# Altium schematic sheet sensor.SchDoc
size A4; SheetNumber: 4; SheetTotal: 4
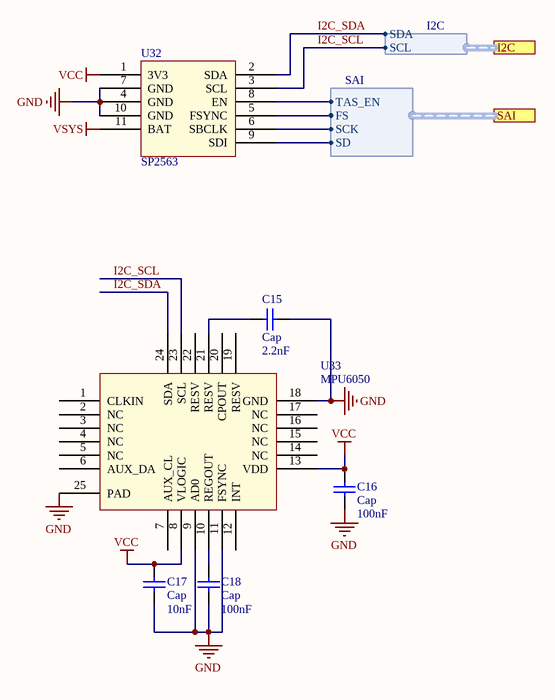
[diagram p0: sensor.SchDoc]

## Parts
C15  Cap  value 2.2nF  [0402]
C16  Cap  value 100nF  [0402]
C17  Cap  value 10nF  [0402]
C18  Cap  value 100nF  [0402]
U32  SP2563  [SP2563]
U33  MPU6050  [QFN24_AW9523B]

## Ports
I2C (harness I2C), SAI (harness SAI)

## Harnesses
I2C: SDA, SCL
SAI: TAS_EN, SCK, FS, SD

## Nets
GND: C15.1 C16.2 C17.2 C18.2 U32.4(GND) U32.7(GND) U32.10(GND) U33.9(AD0) U33.11(FSYNC) U33.18(GND) U33.25(PAD)
VCC: C16.1 C17.1 U32.1(3V3) U33.8(VLOGIC) U33.13(VDD)
VSYS: U32.11(BAT)
I2C_SCL: U32.3(SCL) U33.23(SCL) ; port I2C.SCL
I2C_SDA: U32.2(SDA) U33.24(SDA) ; port I2C.SDA
NetC15_2: C15.2 U33.21(RESV)
NetC18_1: C18.1 U33.10(REGOUT)
NetU32_5: U32.5(FSYNC) ; port SAI.FS
NetU32_6: U32.6(SBCLK) ; port SAI.SCK
NetU32_8: U32.8(EN) ; port SAI.TAS_EN
NetU32_9: U32.9(SDI) ; port SAI.SD

Not connected (* = marked no-connect by the designer): U33 1(CLKIN) 2(NC) 3(NC) 4(NC) 5(NC) 6(AUX_DA) 7(AUX_CL) 12(INT) 14(NC) 15(NC) 16(NC) 17(NC) 19(RESV) 20(CPOUT) 22(RESV)

## Library data of the parts
C15-C18 = Cap: Capacitor; Published: 8-Jun-2000; LatestRevisionDate: 17-Jul-2002; LatestRevisionNote: Re-released for DXP Platform.; PackageReference: RAD-0.3; Publisher: Altium Limited; PackageDescription: Radial Cap, Thru-Hole; 2 Leads; 0.3 in Pin Spacing